# EAGLE design Prototipo_1.2 (EAGLE 6.1)
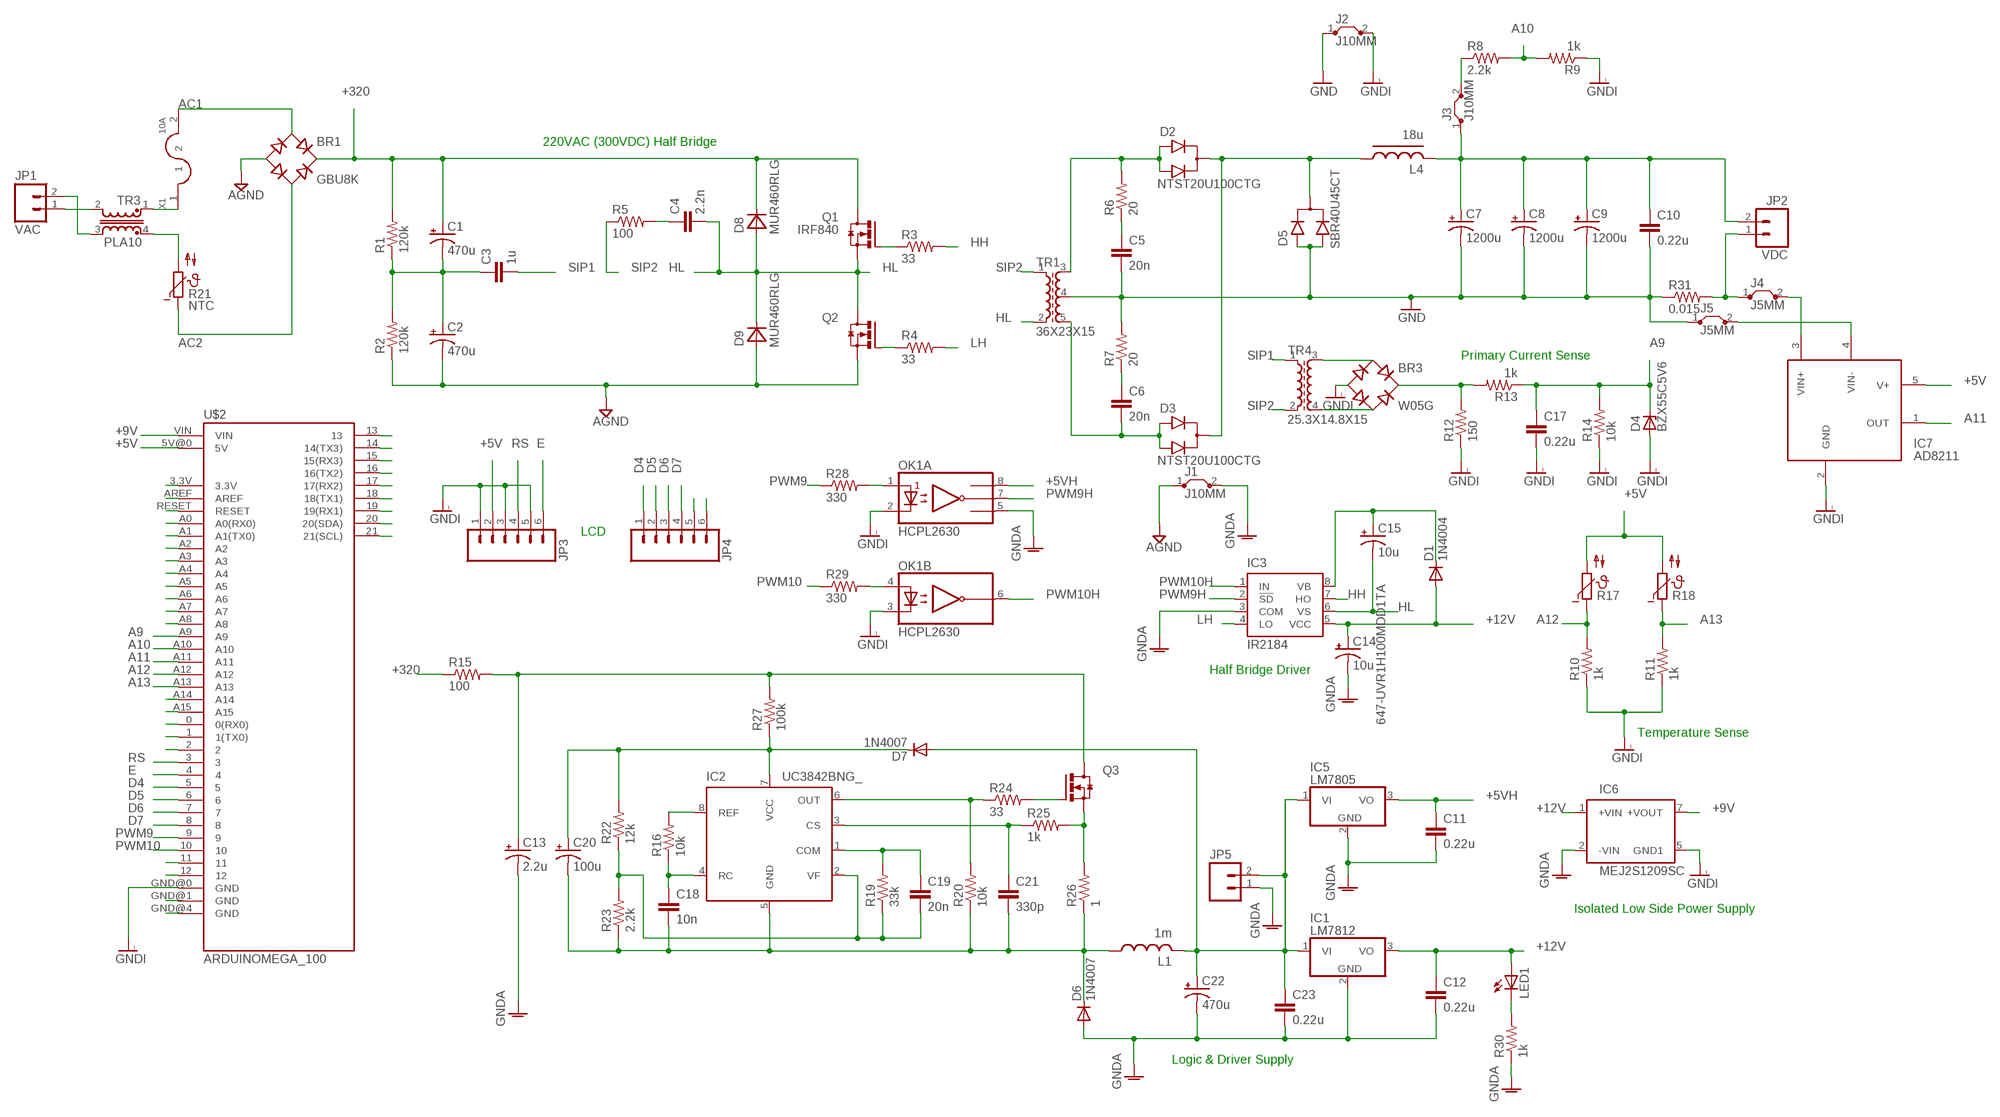
[diagram p0: schematic, sheet 1]

## Parts
BR1  GBU8K  [GBU]
BR3  W05G  [WOG]
C1  470u  CAP_470UF_250V  [CPOL_RADIAL_470UF_250V]
C2  470u  CAP_470UF_250V  [CPOL_RADIAL_470UF_250V]
C3  1u  C22/8  [C22.5B8]
C4  2.2n  C7.5/4  [C7.5B4]
C5  20n  C10/4  [C10B4]
C6  20n  C10/4  [C10B4]
C7  1200u  CAP_POLPTH4  [CPOL-RADIAL-1000UF-25V]
C8  1200u  CAP_POLPTH4  [CPOL-RADIAL-1000UF-25V]
C9  1200u  CAP_POLPTH4  [CPOL-RADIAL-1000UF-25V]
C10  0.22u  C5/3  [C5B3]
C11  0.22u  C5/3  [C5B3]
C12  0.22u  C5/3  [C5B3]
C13  2.2u  CPOL-USE5-5  [E5-5]
C14  10u  CPOL-USE2,5-6E  [E2,5-6E]
C15  10u  CPOL-USE2,5-6E  [E2,5-6E]
C17  0.22u  C5/3  [C5B3]
C18  10n  C7.5/3  [C7.5B3]
C19  20n  C10/4  [C10B4]
C20  100u  CPOL-USE2.5-7  [E2,5-7]
C21  330p  C7.5/4  [C7.5B4]
C22  470u  CPOL-USE5-8.5  [E5-8,5]
C23  0.22u  C5/3  [C5B3]
D1  1N4004  [DO41-10]
D2  NTST20U100CTG  [TO220V]
D3  NTST20U100CTG  [TO220V]
D4  BZX55C5V6  BZX55  [DO35Z10]
D5  SBR40U45CT  [TO220V]
D6  1N4007  1N4004  [DO41-10]
D7  1N4007  1N4004  [DO41-10]
D8  MUR460RLG  [CB429-17]
D9  MUR460RLG  [CB429-17]
IC1  LM7812  788TV  [TO220V]
IC2  UC3842BNG_  [DIL08]
IC3  IR2184  [DIL08]
IC5  LM7805  788TV  [TO220V]
IC6  MEJ2S1209SC  [MEJ2S1209SC]
IC7  AD8211  [RJ-5]
J1  J10MM  [10]
J2  J10MM  [10]
J3  J10MM  [10]
J4  J5MM  [05]
J5  J5MM  [05]
JP1  VAC  M023.5MM  [SCREWTERMINAL-3.5MM-2]
JP2  VDC  M025MM  [SCREWTERMINAL-5MM-2]
JP3  M06SIP  [1X06]
JP4  M06SIP  [1X06]
JP5  M02LOCK_LONGPADS  [1X02_LOCK_LONGPADS]
L1  1m  810-TSL0709RA102KR19  [E5-6]
L4  18u  CHOKE_18U  [CHOKE_18U]
LED1  LED3MM  [LED3MM]
OK1  HCPL2630  [DIL08]
Q1  IRF840  [TO220HV]
Q2  IRF840  [TO220HV]
Q3  IRF840  [TO220HV]
R1  120k  RESISTORPTH-1/4W  [AXIAL-0.4]
R2  120k  RESISTORPTH-1/4W  [AXIAL-0.4]
R3  33  RESISTORPTH-1/2W  [AXIAL-0.5]
R4  33  RESISTORPTH-1/2W  [AXIAL-0.5]
R5  100  R-US_0922V  [0922V]
R6  20  RESISTORPTH-1/2W  [AXIAL-0.5]
R7  20  RESISTORPTH-1/2W  [AXIAL-0.5]
R8  2.2k  RESISTORPTH-1/4W  [AXIAL-0.4]
R9  1k  RESISTORPTH-1/4W  [AXIAL-0.4]
R10  1k  RESISTORPTH-1/4W  [AXIAL-0.4]
R11  1k  RESISTORPTH-1/4W  [AXIAL-0.4]
R12  150  RESISTORPTH-1/4W  [AXIAL-0.4]
R13  1k  RESISTORPTH-1/4W  [AXIAL-0.4]
R14  10k  RESISTORPTH-1/4W  [AXIAL-0.4]
R15  100  RESISTORPTH-1/4W  [AXIAL-0.4]
R16  10k  RESISTORPTH-1/4W  [AXIAL-0.4]
R17  NTC640  [P640]
R18  NTC640  [P640]
R19  33k  RESISTORPTH-1/4W  [AXIAL-0.4]
R20  10k  RESISTORPTH-1/4W  [AXIAL-0.4]
R21  NTC  NTC_5D2-14LD  [C075-042X103]
R22  12k  RESISTORPTH-1/4W  [AXIAL-0.4]
R23  2.2k  RESISTORPTH-1/4W  [AXIAL-0.4]
R24  33  RESISTORPTH-1/2W  [AXIAL-0.5]
R25  1k  RESISTORPTH-1/4W  [AXIAL-0.4]
R26  1  RESISTORPTH-1/4W  [AXIAL-0.4]
R27  100k  RESISTORPTH-1/4W  [AXIAL-0.4]
R28  330  RESISTORPTH-1/4W  [AXIAL-0.4]
R29  330  RESISTORPTH-1/4W  [AXIAL-0.4]
R30  1k  RESISTORPTH-1/4W  [AXIAL-0.4]
R31  0.015  RSENSE  [RSENSE]
TR1  36X23X15  36X23X15_N87  [CORE_36X23X15]
TR3  PLA10  COMMON_MODE_CHOKE_PLA10  [COMMON_MODE_CHOKE_PLA10]
TR4  25.3X14.8X15  25.3X14.8X15_N87  [CORE_25.3X14.8X15]
U$2  ARDUINOMEGA_100  [ARDUINOMEGA_100]
X1  10A  FUSE_HOLDER_5X20  [FUSE_HOLDER_5X20]

## Nets
$N15 [LVHC]: D2.2(C) D3.2(C) D5.2(C) L4.1
+5V [LVLC]: IC7.5(V+) JP3.2 R17.2 R18.2 U$2.5V@0(5V)
+5VH: C11.1 IC5.3(VO) OK1.8(A:VCC)
+9V [LVLC]: IC6.7(+VOUT) U$2.VIN
+12V [HVMC]: C12.1 C14.+ D1.A IC1.3(VO) IC3.5(VCC) IC6.1(+VIN) LED1.A
+320 [HVHC]: BR1.4(+) C1.1(+) D8.C Q1.2(D) R1.P$2 R15.P$1
A9 [LVLC]: C17.1 D4.C R13.P$1 R14.P$2 U$2.A9
A10 [LVLC]: R8.P$2 R9.P$2 U$2.A10
A11 [LVLC]: IC7.1(OUT) U$2.A11
A12 [LVLC]: R10.P$2 R17.1 U$2.A12
A13 [LVLC]: R11.P$2 R18.1 U$2.A13
AC1 [HVHC]: BR1.2(AC1) X1.2
AC2 [HVHC]: BR1.3(AC2) R21.1
AGND [HVHC]: BR1.1(-) C2.2(-) D9.A J1.1 Q2.3(S) R2.P$1
D4 [LVLC]: JP4.1 U$2.5
D5 [LVLC]: JP4.2 U$2.6
D6 [LVLC]: JP4.3 U$2.7
D7 [LVLC]: JP4.4 U$2.8
E [LVLC]: JP3.6 U$2.4
GND [LVHC]: C5.2 C7.2(-) C8.2(-) C9.2(-) C10.2 D5.1(A1) D5.3(A2) J2.1 J5.1 R7.P$2 R31.P$1 TR1.4
GNDA [HVMC]: C11.2 C12.2 C13.- C14.- C22.- C23.2 D6.A IC1.2(GND) IC3.3(COM) IC5.2(GND) IC6.2(-VIN) J1.2 JP5.1 OK1.5(A:GND) R30.P$1
GNDI [LVLC]: BR3.- C17.2 D4.A IC6.5(GND1) IC7.2(GND) J2.2 JP3.1 JP3.3 JP3.5 OK1.2(A:C1) OK1.3(B:C2) R9.P$1 R10.P$1 R11.P$1 R12.P$1 R14.P$1 U$2.GND@0(GND)
HH: IC3.7(HO) R3.P$2
HL [HVHC]: C4.2 C15.- D8.A D9.C IC3.6(VS) Q1.3(S) Q2.2(D) TR1.2
LH: IC3.4(LO) R4.P$2
N$1 [LVLC]: OK1.1(A:A1) R28.P$2
N$2 [HVHC]: R21.2 TR3.4
N$3 [HVHC]: C1.2(-) C2.1(+) C3.1 R1.P$1 R2.P$2
N$4 [LVLC]: J3.2 R8.P$1
N$5 [HVHC]: TR3.1 X1.1
N$6 [LVLC]: BR3.AC1 TR4.3
N$7 [HVHC]: C4.1 R5.2
N$8 [HVHC]: JP1.1 TR3.2
N$9 [HVHC]: JP1.2 TR3.3
N$10: Q1.1(G) R3.P$1
N$11: Q2.1(G) R4.P$1
N$12 [LVHC]: C5.1 R6.P$1
N$13 [LVHC]: D2.1(A1) D2.3(A2) R6.P$2 TR1.3
N$14 [LVSHC]: C7.1(+) C8.1(+) C9.1(+) C10.1 J3.1 JP2.2 L4.2
N$15: IC2.8(REF) R16.P$2
N$16 [LVLC]: BR3.AC2 TR4.4
N$17 [LVHC]: C6.1 R7.P$1
N$18 [LVLC]: BR3.+ R12.P$2 R13.P$2
N$19 [LVHC]: C6.2 D3.1(A1) D3.3(A2) TR1.5
N$20: C18.1 IC2.4(RC) R16.P$1
N$21 [HVMC]: C22.+ C23.1 D7.A IC1.1(VI) IC5.1(VI) JP5.2 L1.-
N$22: C19.1 IC2.1(COM) R19.P$2
N$23: C20.+ D7.C IC2.7(VCC) R22.P$2 R27.P$1
N$24: C19.2 IC2.2(VF) R19.P$1 R22.P$1 R23.P$2
N$25: IC2.6(OUT) R20.P$2 R24.P$1
N$26: C15.+ D1.C IC3.8(VB)
N$27 [HVMC]: C18.2 C20.- C21.2 D6.C IC2.5(GND) L1.+ R20.P$1 R23.P$1 R26.P$1
N$28: Q3.1(G) R24.P$2
N$29 [HVMC]: Q3.3(S) R25.P$2 R26.P$2
N$30 [HVMC]: C13.+ Q3.2(D) R15.P$2 R27.P$2
N$31: C21.1 IC2.3(CS) R25.P$1
N$32 [LVLC]: OK1.4(B:A2) R29.P$2
N$33 [LVLC]: IC7.3(VIN+) J4.2
N$34 [LVLC]: U$2.A14
N$35 [LVLC]: U$2.A15
N$36 [LVLC]: U$2.13
N$37 [LVLC]: U$2.14(14(TX3))
N$38 [LVLC]: U$2.15(15(RX3))
N$39 [LVLC]: U$2.16(16(TX2))
N$40 [LVLC]: U$2.17(17(RX2))
N$41 [LVLC]: U$2.18(18(TX1))
N$42 [LVLC]: U$2.19(19(RX1))
N$43 [LVLC]: U$2.20(20(SDA))
N$44 [LVLC]: U$2.21(21(SCL))
N$45 [LVLC]: U$2.A8
N$46 [LVLC]: U$2.A7
N$47 [LVLC]: U$2.A6
N$48 [LVLC]: U$2.A5
N$49 [LVLC]: U$2.A4
N$50 [LVLC]: U$2.A3
N$51 [LVLC]: U$2.A2
N$52 [LVLC]: U$2.A1(A1(TX0))
N$53 [LVLC]: U$2.A0(A0(RX0))
N$54 [LVLC]: U$2.RESET
N$55 [LVLC]: U$2.AREF
N$56 [LVLC]: U$2.3.3V
N$57 [LVLC]: U$2.0(0(RX0))
N$58 [LVLC]: U$2.1(1(TX0))
N$59 [LVLC]: U$2.2
N$60 [LVLC]: U$2.11
N$61 [LVLC]: U$2.12
N$62 [LVLC]: U$2.GND@1(GND)
N$63 [LVLC]: U$2.GND@4(GND)
N$64 [LVLC]: JP4.5
N$65 [LVLC]: JP4.6
N$66 [HVMC]: LED1.K(C) R30.P$2
N$67 [LVLC]: IC7.4(VIN-) J5.2
N$68 [LVSHC]: J4.1 JP2.1 R31.P$2
PWM9 [LVLC]: R28.P$1 U$2.9
PWM9H: IC3.2(!SD) OK1.7(A:VO1)
PWM10 [LVLC]: R29.P$1 U$2.10
PWM10H: IC3.1(IN) OK1.6(B:VO2)
RS [LVLC]: JP3.4 U$2.3
SIP1 [HVHC]: C3.2 TR4.1
SIP2 [HVHC]: R5.1 TR1.1 TR4.2

## Notes on the sheet
- 220VAC (300VDC) Half Bridge
- Primary Current Sense
- LCD
- Half Bridge Driver
- Temperature Sense
- Isolated Low Side Power Supply
- Logic & Driver Supply

## Library data of the parts
BR1 = finger_sun:GBU8K
BR3 = dbridge:W*G: Vishay/General Semiconductor W005G - W10G Bridge rectifier, 1.5A, 50 to 1000V
C1 C2 = finger_sun:CAP_470UF_250V: Capacitor Polarized These are standard SMD and PTH capacitors. Normally 10uF, 47uF, and 100uF in electrolytic and tantalum varieties. Always verify the external diameter of the through hole cap, it varies with capacity, voltage, and manufacturer. The EIA devices should be standard.
C3 C4 C18 = capacitor-wima:C: CAPACITOR naming: grid - package width
C5 C6 C19 = capacitor-wima:C: CAPACITOR naming: grid - package width; MOUSER: 594-S203M75Z5UN63J0R
C7-C9 = SparkFun-Passives:CAP_POL: Capacitor Polarized These are standard SMD and PTH capacitors. Normally 10uF, 47uF, and 100uF in electrolytic and tantalum varieties. Always verify the external diameter of the through hole cap, it varies with capacity, voltage, and manufacturer. The EIA devices should be standard.; MOUSER: 667-EEU-FR1V122B
C10-C12 C17 C23 = capacitor-wima:C: CAPACITOR naming: grid - package width; MOUSER: 80-R82DC3220AA60K
C13 = adafruit:CPOL-US: POLARIZED CAPACITOR, American symbol; MOUSER: 80-ESH225M400AG3AA
C14 C15 = adafruit:CPOL-US: POLARIZED CAPACITOR, American symbol; MOUSER: 647-UVR1H100MDD1TA
C20 = adafruit:CPOL-US: POLARIZED CAPACITOR, American symbol; MOUSER: 140-REA101M1HBK0811P
C21 = capacitor-wima:C: CAPACITOR naming: grid - package width; MOUSER: 72-VY2331K29Y5SS63V7
C22 = adafruit:CPOL-US: POLARIZED CAPACITOR, American symbol; MOUSER: 647-UVR1V471MPD1TD
D1 = diode:1N4004: DIODE general purpose rectifier, 1 A; MOUSER: 512-1N4007
D2 D3 = finger_sun:NTST20U100CTG
D4 = diode:BZX55: Z DIODE; MOUSER: 78-BZX55C5V6-TAP
D5 = finger_sun:SBR40U45CT
D6 D7 = diode:1N4004: DIODE general purpose rectifier, 1 A
D8 D9 = finger_sun:MUR460RLG
IC1 = linear:78*: Positive VOLTAGE REGULATOR Source: http://cache.national.com/ds/LM/LM78L05.pdf http://www.fairchildsemi.com/ds/LM/LM7805.pdf; MOUSER: 863-MC7812CTG
IC2 = finger_sun:UC3842BNG_
IC3 = finger_sun:IR2184: HALF-BRIDGE DRIVER www.irf.com Data Sheet No. PD60174 revG Features *Floating channel designed for bootstrap operation Fully operational to +600V *Tolerant to negative transient voltage dV/dt immune * Gate drive supply range from 10 to 20V * Undervoltage lockout for both channels * 3.3V and 5V input logic compatible * Matched propagation delay for both channels * Logic and power ground +/- 5V offset. * Lower di/dt gate driver for better noise immunity * Output source/sink current capability 1.4A/1.8A * Also available LEAD-FREE (PbF); MF: INTERNATIONAL RECTIFIER(IR); MPN: IR2184
IC5 = linear:78*: Positive VOLTAGE REGULATOR Source: http://cache.national.com/ds/LM/LM78L05.pdf http://www.fairchildsemi.com/ds/LM/LM7805.pdf
IC6 = finger_sun:MEJ2S1209SC
IC7 = finger_sun:AD8211
J1-J5 = jumper:J: Bridge
JP1 JP2 JP5 = SparkFun-Connectors:M02: Header 2 Standard 2-pin 0.1" header. Use with straight break away headers (SKU : PRT-00116), right angle break away headers (PRT-00553), swiss pins (PRT-00743), machine pins (PRT-00117), and female headers (PRT-00115). Molex polarized connector foot print use with SKU : PRT-08233 with associated crimp pins and housings.
JP3 JP4 = SparkFun-Connectors:M06: Header 6 Standard 6-pin 0.1" header. Use with straight break away headers (SKU : PRT-00116), right angle break away headers (PRT-00553), swiss pins (PRT-00743), machine pins (PRT-00117), and female headers (PRT-00115). Molex polarized connector foot print use with SKU : PRT-08094 with associated crimp pins and housings. NOTES ON THE VARIANTS LOCK and LOCK_LONGPADS... This footprint was designed to help hold the alignment of a through-hole component (i.e. 6-pin header) while soldering it into place. You may notice that each hole has been shifted either up or down by 0.005 of an inch from it's more standard position (which is a perfectly straight line). This slight alteration caused the pins (the squares in the middle) to touch the edges of the holes. Because they are alternating, it causes a "brace" to hold the component in place. 0.005 has proven to be the perfect amount of "off-center" position when using our standard breakaway headers. Although looks a little odd when you look at the bare footprint, once you have a header in there, the alteration is very hard to notice. Also, if you push a header all the way into place, it is covered up entirely on the bottom side. This idea of altering the position of holes to aid alignment will be further integrated into the Sparkfun Library for other footprints. It can help hold any component with 3 or more connection pins.
L1 = finger_sun:810-TSL0709RA102KR19; MOUSER: 810-TSL0709RA102KR19
L4 = finger_sun:CHOKE_18U: Choke Toroid 18uH 18.5A 652-2300LL-180-V-RC
LED1 = adafruit:LED: LED OSRAM: - CHIPLED LG R971, LG N971, LY N971, LG Q971, LY Q971, LO R971, LY R971 LH N974, LH R974 LS Q976, LO Q976, LY Q976 LO Q996 - Hyper CHIPLED LW Q18S LB Q993, LB Q99A, LB R99A - SideLED LS A670, LO A670, LY A670, LG A670, LP A670 LB A673, LV A673, LT A673, LW A673 LH A674 LY A675 LS A676, LA A676, LO A676, LY A676, LW A676 LS A679, LY A679, LG A679 - Hyper Micro SIDELED® LS Y876, LA Y876, LO Y876, LY Y876 LT Y87S - SmartLED LW L88C, LW L88S LB L89C, LB L89S, LG L890 LS L89K, LO L89K, LY L89K LS L896, LA L896, LO L896, LY L896 - TOPLED LS T670, LO T670, LY T670, LG T670, LP T670 LSG T670, LSP T670, LSY T670, LOP T670, LYG T670 LG T671, LOG T671, LSG T671 LB T673, LV T673, LT T673, LW T673 LH T674 LS T676, LA T676, LO T676, LY T676, LB T676, LH T676, LSB T676, LW T676 LB T67C, LV T67C, LT T67C, LS T67K, LO T67K, LY T67K, LW E67C LS E67B, LA E67B, LO E67B, LY E67B, LB E67C, LV E67C, LT E67C LW T67C LS T679, LY T679, LG T679 LS T770, LO T770, LY T770, LG T770, LP T770 LB T773, LV T773, LT T773, LW T773 LH T774 LS E675, LA E675, LY E675, LS T675 LS T776, LA T776, LO T776, LY T776, LB T776 LHGB T686 LT T68C, LB T68C - Hyper Mini TOPLED® LB M676 - Mini TOPLED Santana® LG M470 LS M47K, LO M47K, LY M47K Source: http://www.osram.convergy.de/
OK1 = optocoupler:HCPL2630: HEWLETT PACKARD OPTO COUPLER; MF: AGILENT TECHNOLOGIES; MPN: HCPL-2630-000E; OC_FARNELL: 9994904; OC_NEWARK: 88H7813
Q1-Q3 = finger_sun:IRF840
R1 R2 = SparkFun-Passives:RESISTOR: Resistor Basic schematic elements and footprints for 0603, 1206, and PTH resistors.; MOUSER: 660-MF1/4DCT52R1203F
R3 R4 R8 = SparkFun-Passives:RESISTOR: Resistor Basic schematic elements and footprints for 0603, 1206, and PTH resistors.
R5 = adafruit:R-US_: RESISTOR, American symbol
R6 R7 = SparkFun-Passives:RESISTOR: Resistor Basic schematic elements and footprints for 0603, 1206, and PTH resistors.; MOUSER: 603-MFR50SFTE52-20R
R9-R11 R13 R25 R30 = SparkFun-Passives:RESISTOR: Resistor Basic schematic elements and footprints for 0603, 1206, and PTH resistors.; MOUSER: 660-MF1/4DC1001F
R12 = SparkFun-Passives:RESISTOR: Resistor Basic schematic elements and footprints for 0603, 1206, and PTH resistors.; MOUSER: 660-MF1/4DC1500F
R14 R16 R20 = SparkFun-Passives:RESISTOR: Resistor Basic schematic elements and footprints for 0603, 1206, and PTH resistors.; MOUSER: 660-MF1/4DC1002F
R15 = SparkFun-Passives:RESISTOR: Resistor Basic schematic elements and footprints for 0603, 1206, and PTH resistors.; MOUSER: 660-MF1/4DC1000F
R17 R18 = ptc-ntc:NTC640: PHILIPS NTC; MOUSER: 594-NTCLE203E3502JB0; OC_FARNELL: unknown; OC_NEWARK: unknown
R19 = SparkFun-Passives:RESISTOR: Resistor Basic schematic elements and footprints for 0603, 1206, and PTH resistors.; MOUSER: 660-MF1/4DC3302F
R21 = finger_sun:NTC_5D2-14LD
R22 = SparkFun-Passives:RESISTOR: Resistor Basic schematic elements and footprints for 0603, 1206, and PTH resistors.; MOUSER: 660-MF1/4DCT52R1202F
R23 = SparkFun-Passives:RESISTOR: Resistor Basic schematic elements and footprints for 0603, 1206, and PTH resistors.; MOUSER: 660-MF1/4DCT52R2201F
R24 = SparkFun-Passives:RESISTOR: Resistor Basic schematic elements and footprints for 0603, 1206, and PTH resistors.; MOUSER: 603-MFR50SFTE52-33R
R26 = SparkFun-Passives:RESISTOR: Resistor Basic schematic elements and footprints for 0603, 1206, and PTH resistors.; MOUSER: 660-MF1/4DCT52R1R00F
R27 = SparkFun-Passives:RESISTOR: Resistor Basic schematic elements and footprints for 0603, 1206, and PTH resistors.; MOUSER: 660-MF1/4DC1003F
R28 R29 = SparkFun-Passives:RESISTOR: Resistor Basic schematic elements and footprints for 0603, 1206, and PTH resistors.; MOUSER: MF1/4DC3300F
R31 = finger_sun:RSENSE: Open Air Sense Resistor - TT Electronics
TR1 = finger_sun:36X23X15_N87
TR3 = finger_sun:COMMON_MODE_CHOKE_PLA10: Common Mode Choke (EMI Filter) PLA10
TR4 = finger_sun:25.3X14.8X15_N87
U$2 = prymia:ARDUINOMEGA_100
X1 = finger_sun:FUSE_HOLDER_5X20: Fuse Holder - Fuse Cartridge 5x20mm

## Net classes
0 HVLC: clearance 0.762 mm
1 HVHC: width 0.762 mm, clearance 1.016 mm to class 0, clearance 1.016 mm
2 LVHC: width 2.794 mm, clearance 5.08 mm to class 0, clearance 5.08 mm to class 1
3 LVLC: width 0.381 mm, clearance 5.08 mm to class 0, clearance 5.08 mm to class 1, clearance 0.508 mm
4 LVSHC: width 5.08 mm, clearance 5.08 mm to class 0, clearance 5.08 mm to class 1
5 HVMC: width 0.762 mm, clearance 0.762 mm to class 0, clearance 1.27 mm to class 1, clearance 5.08 mm to class 2, clearance 5.08 mm to class 3, clearance 5.08 mm to class 4, clearance 0.889 mm

## Board
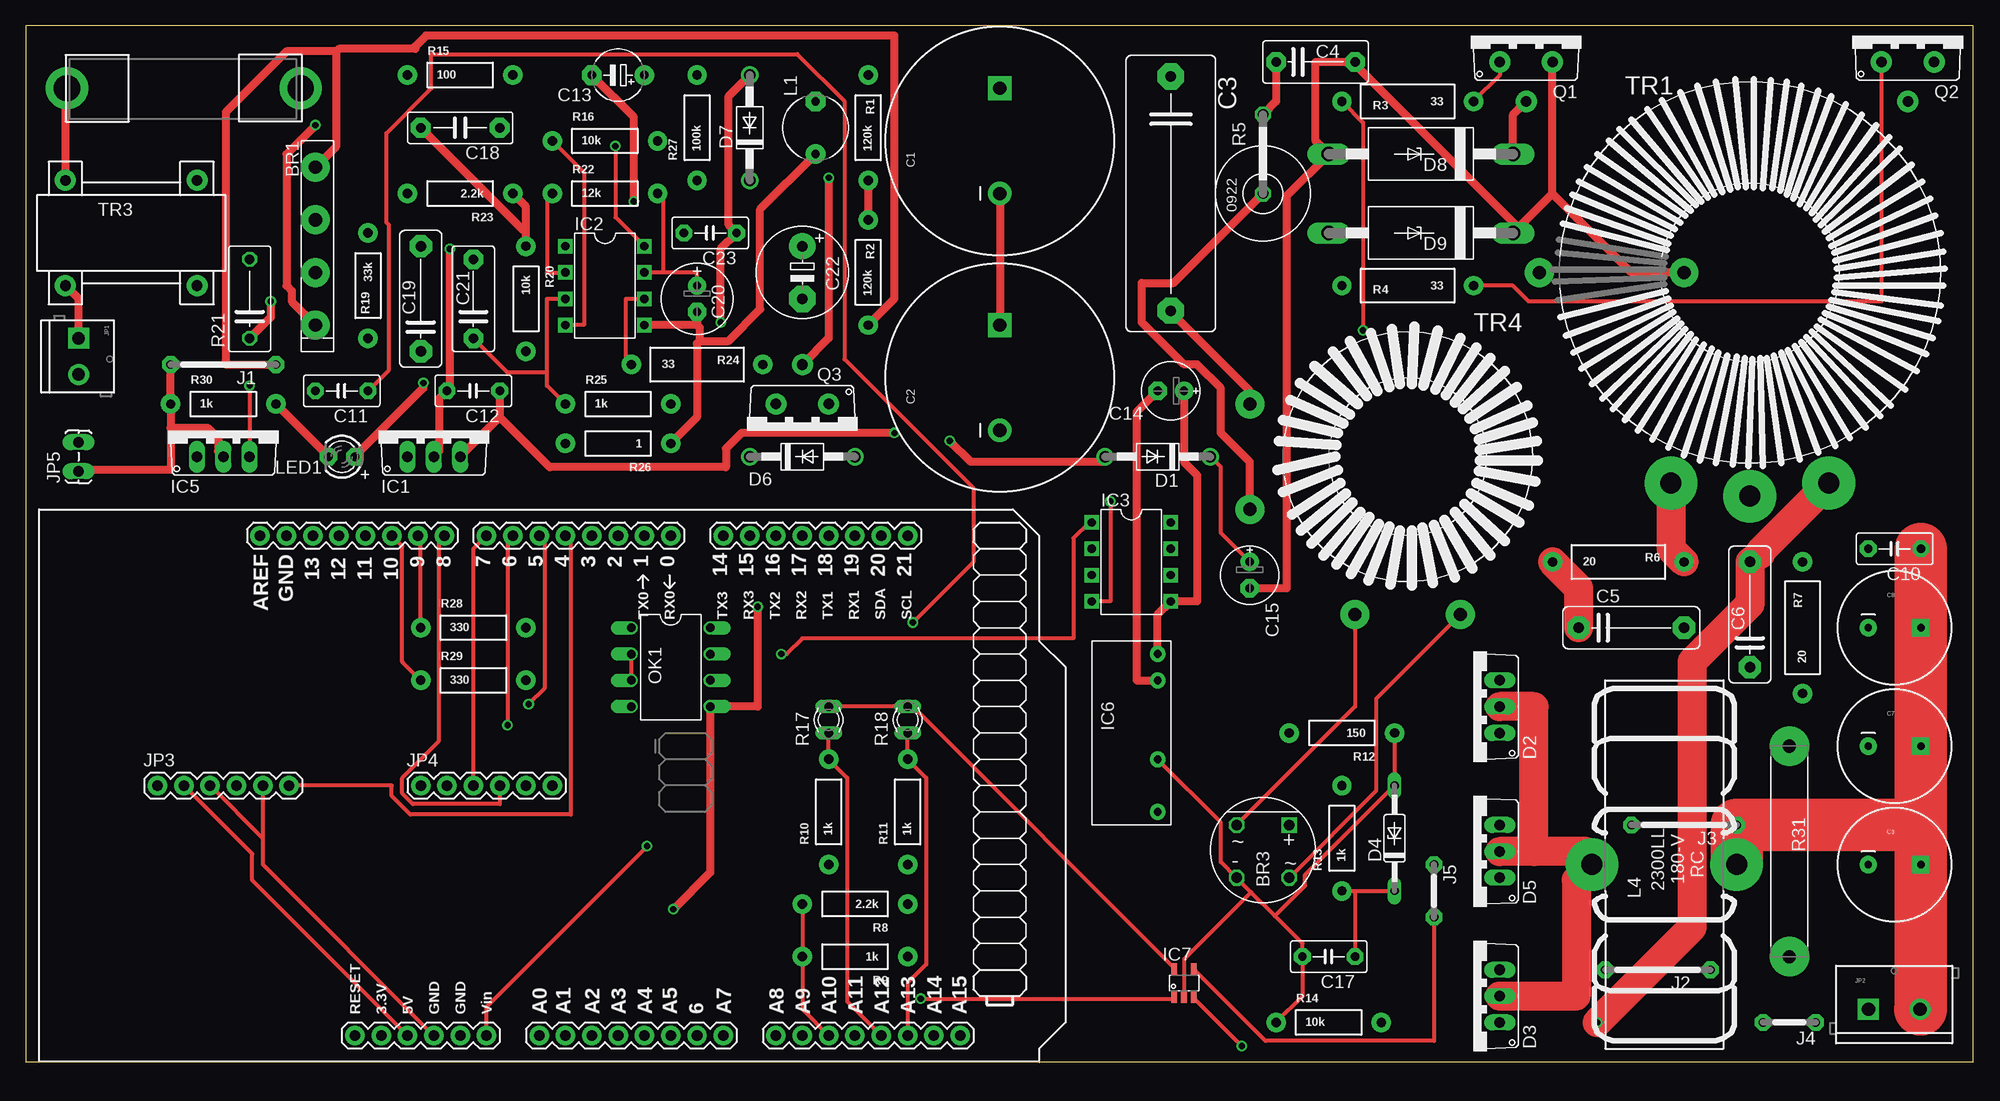
[diagram p1: board, top side]
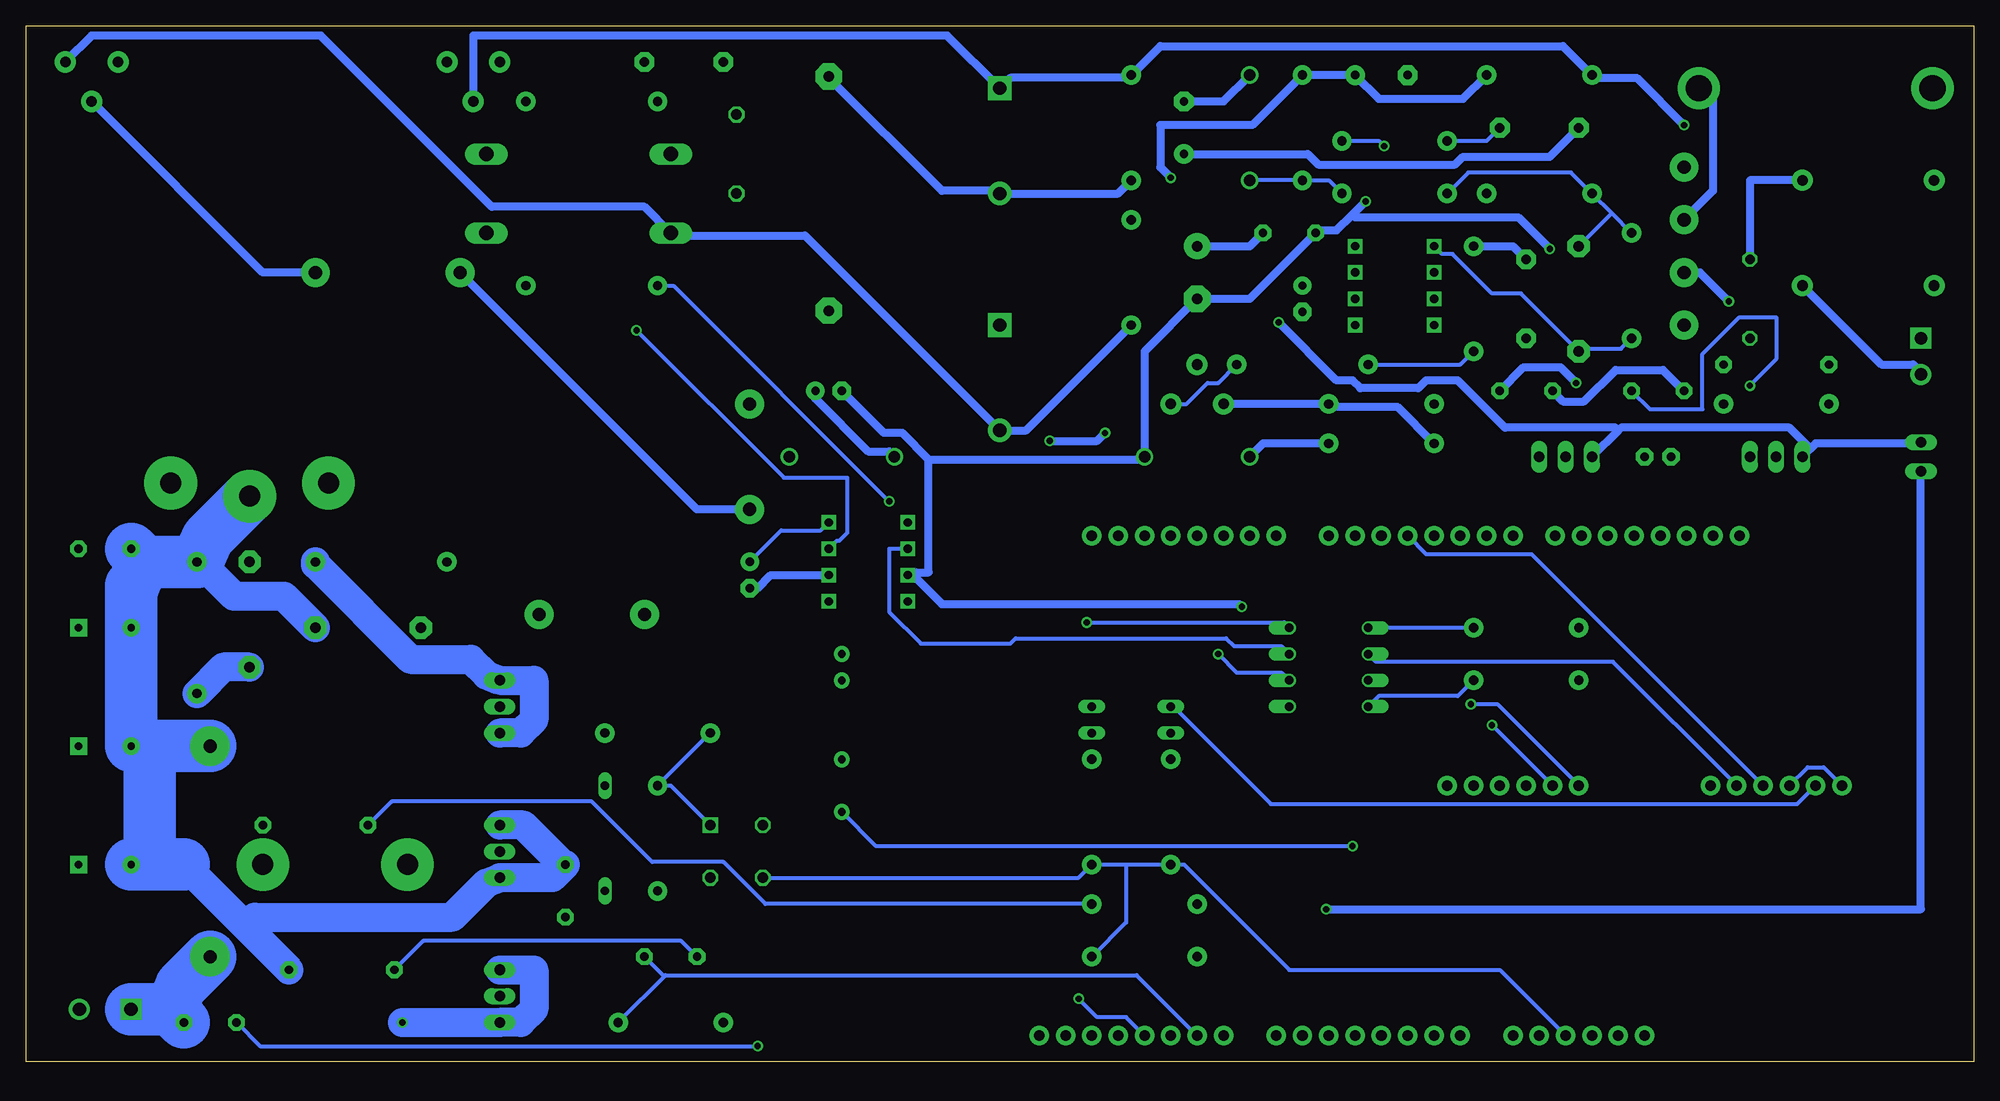
[diagram p2: board, bottom side, seen from below]

Size 187.94 x 100 mm. Coordinates in mm from the lower left corner, seen from the top.
Outline: 0,0 187.94,0 187.94,100 0,100 0,0
Copper layers (1*16): Top 0.035mm / dielectric 1.5mm / Bottom 0.035mm
Design rules: minimum track width 15mil, minimum drill 24mil, track to track 15mil, track to pad 15mil, pad to pad 15mil, via to via 15mil, smd to smd 15mil, copper to edge 40mil, drill to drill 8mil, minimum pad ring 10mil, minimum via ring 8mil, stop-mask expansion 4mil, vias tented up to drill 0mil, thermal gap 10mil

### Footprints (pad centres in the part's own frame; a part is rotated, then mirrored left to right if it is on the bottom)
GBU = drill 1.27 pad 2.794: 1 -5.08,0; 2 0,0; 3 5.08,0; 4 10.16,0
WOG = drill 1.016 square: + 2.54,2.54 | drill 1.016 octagon: - -2.54,-2.54; AC1 -2.54,2.54; AC2 2.54,-2.54
CPOL_RADIAL_470UF_250V = drill 1.27 pad 2.286 square: 1 5.08,0 | drill 1.27 pad 2.286: 2 -5.08,0
C22.5B8 = drill 1.016 pad 2.54 octagon: 1 -11.303,0; 2 11.303,0
C7.5B4 = drill 0.914 pad 1.905 octagon: 1 -3.81,0; 2 3.81,0
C10B4 = drill 1.016 pad 2.159 octagon: 1 -5.08,0; 2 5.08,0
CPOL-RADIAL-1000UF-25V = drill 0.7 pad 1.651 square: 1 2.54,0 | drill 0.7 pad 1.651: 2 -2.54,0
C5B3 = drill 0.813 pad 1.6 octagon: 1 -2.54,0; 2 2.54,0
E5-5 = drill 0.813 pad 1.905: + -2.54,0 | drill 0.813 pad 1.905 octagon: - 2.54,0
E2,5-6E = drill 0.813 pad 1.778: + -1.27,0 | drill 0.813 pad 1.778 octagon: - 1.27,0
C7.5B3 = drill 0.914 pad 1.905 octagon: 1 -3.81,0; 2 3.81,0
E2,5-7 = drill 0.813 pad 1.778: + -1.27,0 | drill 0.813 pad 1.778 octagon: - 1.27,0
E5-8,5 = drill 1.016 pad 2.54: + -2.54,0 | drill 1.016 pad 2.54 octagon: - 2.54,0
DO41-10 = drill 1.118: A 5.08,0; C -5.08,0
TO220V = drill 1.016 long: 1 -2.54,-2.54; 2 0,-2.54; 3 2.54,-2.54
DO35Z10 = drill 0.813 long: A 5.08,0; C -5.08,0
CB429-17 = drill 1.397 long: A 8.89,0; C -8.89,0
DIL08 = drill 0.8 pad 1.4 square: 1 -3.81,-3.81; 2 -1.27,-3.81; 3 1.27,-3.81; 4 3.81,-3.81; 5 3.81,3.81; 6 1.27,3.81; 7 -1.27,3.81; 8 -3.81,3.81
MEJ2S1209SC = drill 0.762 pad 1.524: 1 0,0; 2 2.54,0; 5 10.16,0; 7 15.24,0
RJ-5 = smd 0.55 x 1.2: 1 -0.95,-1.3; 2 0,-1.3; 3 0.95,-1.3; 4 0.95,1.3; 5 -0.95,1.3
10 = drill 0.813 pad 1.6 octagon: 1 -5.08,0; 2 5.08,0
05 = drill 0.813 pad 1.6 octagon: 1 -2.54,0; 2 2.54,0
SCREWTERMINAL-3.5MM-2 = drill 1.2 pad 2.032 square: 1 0,0 | drill 1.2 pad 2.032: 2 3.5,0
SCREWTERMINAL-5MM-2 = drill 1.3 pad 2.032 square: 1 0,0 | drill 1.3 pad 2.032: 2 5,0
1X06 = drill 1.016 pad 1.88: 1 0,0; 2 2.54,0; 3 5.08,0; 4 7.62,0; 5 10.16,0; 6 12.7,0
1X02_LOCK_LONGPADS = drill 1.016 long: 1 -0.127,0; 2 2.667,0
E5-6 = drill 0.813 pad 1.905: + -2.54,0 | drill 0.813 pad 1.905 octagon: - 2.54,0
CHOKE_18U = drill 2.032 pad 5.08: 1 0,0; 2 0,-13.97
LED3MM = drill 0.813 pad 1.676 octagon: A -1.27,0; K 1.27,0
DIL08' = drill 0.813 offset: 1 -3.81,-3.81; 2 -1.27,-3.81; 3 1.27,-3.81; 4 3.81,-3.81; 5 3.81,3.81; 6 1.27,3.81; 7 -1.27,3.81; 8 -3.81,3.81
TO220HV = drill 1.016 pad 2.032: 1 -2.54,0; 2 0,-3.81; 3 2.54,0
AXIAL-0.4 = drill 0.9 pad 1.88: P$1 -5.08,0; P$2 5.08,0
AXIAL-0.5 = drill 0.9 pad 1.88: P$1 -6.35,0; P$2 6.35,0
0922V = drill 1.016 octagon: 1 -5.08,0; 2 2.54,0
P640 = drill 0.813 long: 1 -1.27,0; 2 1.27,0
C075-042X103 = drill 0.914 octagon: 1 -3.81,0; 2 3.81,0
RSENSE = drill 1.27 pad 3.81: P$1 -10.16,0; P$2 10.16,0
CORE_36X23X15 = drill 1.27 pad 2.794: 1 -20.32,0; 2 -6.35,0 | drill 2.032 pad 5.08: 3 -7.62,-20.32; 4 0,-21.59; 5 7.62,-20.32
COMMON_MODE_CHOKE_PLA10 = drill 1.016 pad 2.032: 1 -6.35,5.08; 2 -6.35,-5.08; 3 6.35,-5.08; 4 6.35,5.08
CORE_25.3X14.8X15 = drill 1.27 pad 2.794: 1 -15.24,5.08; 2 -15.24,-5.08; 3 -5.08,-15.24; 4 5.08,-15.24
ARDUINOMEGA_100 = drill 1.016 pad 1.88: 0 60.96,50.8; 1 58.42,50.8; 2 55.88,50.8; 3 53.34,50.8; 3.3V 33.02,2.54; 4 50.8,50.8; 5 48.26,50.8; 5V@0 35.56,2.54; 6 45.72,50.8; 7 43.18,50.8; 8 39.116,50.8; 9 36.576,50.8; 10 34.036,50.8; 11 31.496,50.8; 12 28.956,50.8; 13 26.416,50.8; 14 66.04,50.8; 15 68.58,50.8; 16 71.12,50.8; 17 73.66,50.8; 18 76.2,50.8; 19 78.74,50.8; 20 81.28,50.8; 21 83.82,50.8; A0 48.26,2.54; A1 50.8,2.54; A2 53.34,2.54; A3 55.88,2.54; A4 58.42,2.54; A5 60.96,2.54; A6 63.5,2.54; A7 66.04,2.54; A8 71.12,2.54; A9 73.66,2.54; A10 76.2,2.54; A11 78.74,2.54; A12 81.28,2.54; A13 83.82,2.54; A14 86.36,2.54; A15 88.9,2.54; AREF 21.336,50.8; GND@0 38.1,2.54; GND@1 40.64,2.54; GND@4 23.876,50.8; RESET 30.48,2.54; VIN 43.18,2.54
FUSE_HOLDER_5X20 = drill 2.54 pad 4.064: 1 0,12.54; 2 0,-10

### Placement (x,y rotation side)
BR1  27.94,81.28 270 top
BR3  119.38,20.32 0 top
C1  93.98,88.9 90 top
C2  93.98,66.04 90 top
C3  110.49,83.82 270 top
C4  124.46,96.52 0 top
C5  154.94,41.91 0 top
C6  166.37,43.18 90 top
C7  180.34,30.48 0 top
C8  180.34,41.91 0 top
C9  180.34,19.05 0 top
C10  180.34,49.53 180 top
C11  30.48,64.77 180 top
C12  43.18,64.77 180 top
C13  57.15,95.25 180 top
C14  110.49,64.77 180 top
C15  118.11,46.99 270 top
C17  125.73,10.16 180 top
C18  41.91,90.17 180 top
C19  38.1,73.66 90 top
C20  64.77,73.66 270 top
C21  43.18,73.66 90 top
C22  74.93,76.2 270 top
C23  66.04,80.01 180 top
D1  109.22,58.42 180 top
D2  139.7,34.29 90 top
D3  139.7,6.35 90 top
D4  132.08,21.59 90 top
D5  139.7,20.32 90 top
D6  74.93,58.42 0 top
D7  69.85,90.17 90 top
D8  134.62,87.63 180 top
D9  134.62,80.01 180 top
IC1  39.37,60.96 0 top
IC2  55.88,74.93 270 top
IC3  106.68,48.26 270 top
IC5  19.05,60.96 0 top
IC6  109.22,39.37 270 top
IC7  111.76,7.62 0 top
J1  19.05,67.31 180 top
J2  157.48,8.89 180 top
J3  160.02,22.86 180 top
J4  170.18,3.81 180 top
J5  135.89,16.51 270 top
JP1  5.08,69.85 270 top
JP2  177.8,5.08 0 top
JP3  12.7,26.67 0 top
JP4  38.1,26.67 0 top
JP5  5.08,57.15 90 top
L1  76.2,90.17 90 top
L4  151.13,19.05 90 top
LED1  30.48,58.42 180 top
OK1  HCPL2630  [DIL08']  62.23,38.1 270 top
Q1  144.78,96.52 0 top
Q2  181.61,96.52 0 top
Q3  74.93,63.5 180 top
R1  81.28,90.17 90 top
R2  81.28,76.2 90 top
R3  133.35,92.71 180 top
R4  133.35,74.93 180 top
R5  119.38,88.9 90 top
R6  153.67,48.26 0 top
R7  171.45,41.91 90 top
R8  80.01,15.24 180 top
R9  80.01,10.16 180 top
R10  77.47,24.13 90 top
R11  85.09,24.13 90 top
R12  127,31.75 180 top
R13  127,21.59 90 top
R14  125.73,3.81 0 top
R15  41.91,95.25 0 top
R16  55.88,88.9 0 top
R17  77.47,33.02 90 top
R18  85.09,33.02 90 top
R19  33.02,74.93 270 top
R20  48.26,73.66 270 top
R21  21.59,73.66 90 top
R22  55.88,83.82 0 top
R23  41.91,83.82 180 top
R24  64.77,67.31 0 top
R25  57.15,63.5 0 top
R26  57.15,59.69 180 top
R27  64.77,90.17 90 top
R28  43.18,41.91 0 top
R29  43.18,36.83 0 top
R30  19.05,63.5 0 top
R31  170.18,20.32 270 top
TR1  166.37,76.2 0 top
TR3  10.16,80.01 0 top
TR4  133.35,58.42 0 top
U$2  1.27,0 0 top
X1  16.51,93.98 90 top

### Tracks (layer width: path | path; a pad name or v marks a point on that pad's centre or on a via)
$N15
  Top 2.794: D3.2 149.61,6.35 149.61,17.53 L4.1 150.62,20.32 145.54,20.32 | 145.54,20.32 D5.2 | D2.2 145.54,34.29 145.54,20.32
+5V
  Top 0.381: JP3.2 21.84,20.07 21.84,17.53 U$2.5V@0 | IC7.5 110.74,9.14 85.6,34.29 R18.2 R17.2
  Bottom 0.381: JP3.2 17.02,24.89 67.82,24.89 77.22,34.29 R17.2
+5VH  (via drill 0.61)
  Top 0.381: v85.6,42.42 91.44,48.26 91.44,55.37 78.99,67.82 78.99,92.71 74.42,97.28 39.12,97.28 39.12,93.98 34.8,89.66 34.8,81.03 35.05,80.77 35.05,66.8 C11.1 | v21.59,65.28 IC5.3
  Bottom 0.381: OK1.8 66.55,42.42 v85.6,42.42 | v21.59,65.28 19.05,67.82 19.05,71.88 22.61,71.88 26.16,68.33 26.16,62.99 31.24,62.99 C11.1
+9V  (via drill 0.61)
  Top 0.381: v59.94,20.83 44.45,5.33 U$2.VIN
  Bottom 0.381: IC6.7 105.92,20.83 v59.94,20.83
+12V  (via drill 0.61)
  Top 0.762: 45.72,62.23 IC1.3 | C12.1 45.72,62.23 | LED1.A 38.35,65.02 v38.35,65.53 | IC6.1 109.22,43.18 IC3.5 113.03,44.45 113.03,56.64 111.76,57.91 C14.+ | 45.72,62.23 50.55,57.4 67.56,57.4 67.56,59.18 69.09,60.71 v83.82,60.71 | v89.15,59.94 91.19,57.91 104.14,57.91 D1.A
  Bottom 0.762: v38.35,65.53 39.88,67.06 43.43,67.06 C12.1 | D1.A 104.65,58.93 106.68,58.93 111.76,64.01 C14.+ | v83.82,60.71 84.58,59.94 v89.15,59.94
+320  (via drill 0.61)
  Top 0.762: Q1.2 143.51,91.44 D8.C | BR1.4 25.65,73.41 25.65,74.42 25.15,74.93 25.15,87.63 v27.94,90.42
  Bottom 0.762: v27.94,90.42 32.51,95 36.58,95 R15.P$1 39.62,98.04 78.49,98.04 R1.P$2 81.53,95 92.96,95 C1.1 99.06,99.06 144.78,99.06 Q1.2
A9
  Top 0.381: R13.P$1 128.27,16.51 | 128.27,16.51 D4.C | 128.27,16.51 C17.1
  Bottom 0.381: U$2.A9 80.77,8.38 126.24,8.38 | 126.24,8.38 126.49,8.38 C17.1 | 126.24,8.38 R14.P$2
A10
  Top 0.381: R8.P$2 R9.P$2 74.93,5.08 U$2.A10
A11  (via drill 0.61)
  Top 0.381: v86.36,6.1 110.74,6.1 IC7.1
  Bottom 0.381: v86.36,6.1 84.58,4.32 81.79,4.32 U$2.A11
A12
  Top 0.381: R17.1 R10.P$2 79.25,27.43 79.25,5.84 U$2.A12
A13
  Top 0.381: R18.1 R11.P$2 86.87,27.43 86.87,9.4 85.09,7.62 U$2.A13
AC1
  Bottom 0.762: BR1.2 25.15,84.07 25.15,93.98 X1.2
AC2  (via drill 0.61)
  Top 0.762: R21.1 23.62,71.88 v23.62,73.41
  Bottom 0.762: v23.62,73.41 26.42,76.2 BR1.3
AGND
  Top 0.762: J1.1 19.3,67.31 19.3,91.69 25.15,97.54 29.97,97.54 | 29.97,97.54 29.97,88.39 BR1.1 | R2.P$1 83.82,73.66 83.82,99.06 38.61,99.06 37.59,98.04 37.59,97.79 30.23,97.79 29.97,97.54
  Bottom 0.762: R2.P$1 91.44,60.96 C2.2 112.78,79.76 125.48,79.76 D9.A 128.27,82.55 143,82.55 159.51,99.06 181.61,99.06 Q2.3
D4  (via drill 0.61)
  Top 0.381: v48.51,34.54 50.04,36.07 50.04,50.29 U$2.5
  Bottom 0.381: JP4.1 45.97,34.54 v48.51,34.54
D5  (via drill 0.61)
  Top 0.381: v46.48,32.51 46.48,50.29 U$2.6
  Bottom 0.381: v46.48,32.51 JP4.2
D6
  Top 0.381: JP4.3 43.18,49.53 U$2.7
D7
  Top 0.381: U$2.8 39.88,50.29 39.88,30.99 36.32,27.43 36.32,25.91 37.34,24.89 45.72,24.89 JP4.4
E
  Top 0.381: JP3.6 35.31,26.67 35.31,25.65 37.08,23.88 52.58,23.88 52.58,50.29 U$2.4
GND
  Bottom 2.794: C5.2 163.07,44.96 167.89,44.96 170.43,47.5 R7.P$2 | J5.1 136.02,18.92 | 136.02,18.92 137.16,17.78 D5.1 143.51,17.27 146.81,13.97 165.86,13.97 166.75,13.08 | D5.3 139.95,22.86 136.02,18.92 | 172.72,19.05 166.75,13.08 | 166.75,13.08 J2.1
  Bottom 5.08: 176.53,48.26 C10.2 | 176.53,48.26 R7.P$2 170.43,50.55 TR1.4 | 176.53,48.26 177.55,45.97 177.8,45.97 C8.2 C7.2 176.02,30.48 | 172.72,19.05 176.02,19.05 | 176.02,19.05 C9.2 | R31.P$1 176.02,30.48 | 176.02,30.48 176.02,19.05
GNDA  (via drill 0.61)
  Top 0.762: IC1.2 39.88,58.93 39.88,64.01 C12.2 40.89,65.02 v40.89,78.49 | C13.- 58.67,91.19 v58.67,83.06 | IC6.2 107.19,36.83 107.19,62.74 C14.- | 13.97,61.21 R30.P$1 J1.2 | 13.97,61.21 13.97,57.15 5.08,57.15 JP5.1 | IC5.2 18.54,58.93 18.54,60.2 17.53,61.21 13.97,61.21 | v70.61,43.94 70.61,34.29 OK1.5 66.04,18.29 v62.48,14.73
  Bottom 0.762: C11.2 29.97,66.8 34.54,66.8 37.59,63.75 39.62,63.75 C12.2 | 59.94,81.79 61.47,80.26 63.25,80.26 C23.2 69.85,73.66 C22.- 80.01,68.58 D6.A 80.26,58.17 100.84,58.17 | 59.94,81.79 v58.67,83.06 | v40.89,78.49 43.94,81.53 59.69,81.53 59.94,81.79 | v70.61,43.94 70.87,44.2 99.57,44.2 102.36,46.99 | IC3.3 102.36,46.99 | JP5.1 5.08,14.73 v62.48,14.73 | C14.- 105.16,60.71 103.38,60.71 100.84,58.17 | 100.84,58.17 100.84,47.24 102.11,47.24 102.36,46.99
GNDI
  Top 0.381: OK1.2 OK1.3 | U$2.GND@0 22.86,19.05 22.86,21.59 | JP3.5 22.86,21.59 | 22.86,21.59 JP3.3 | R12.P$1 D4.A 123.44,18.03 123.44,17.02 120.52,14.1 | 120.52,14.1 123.19,11.43 C17.2 123.19,6.35 R14.P$1 | 120.52,14.1 118.24,16.38 | 118.24,16.38 BR3.- 115.32,19.3 115.32,23.11 IC6.5 | IC7.2 111.76,9.91 118.24,16.38
  Bottom 0.381: JP3.1 14.48,28.45 16,28.45 JP3.3 | OK1.2 57.66,38.61 34.8,38.61 JP3.5 | 81.79,19.05 R11.P$1 86.36,17.78 BR3.- | 81.79,19.05 R10.P$1 76.2,19.05 66.04,8.89 45.72,8.89 U$2.GND@0 | R9.P$1 81.79,13.46 81.79,19.05 | J2.2 149.61,11.68 124.71,11.68 C17.2
HH  (via drill 0.61)
  Top 0.381: v129.03,70.61 129.03,90.68 R3.P$2
  Bottom 0.381: IC3.7 109.73,50.29 109.47,50.29 108.71,51.05 108.71,56.39 114.81,56.39 v129.03,70.61
HL
  Top 0.762: 147.32,83.82 Q1.3 | 147.32,83.82 D9.C 143.76,80.77 128.52,96.01 128.52,96.27 C4.2 124.46,96.52 124.46,88.9 D8.A 121.67,83.57 121.67,45.72 C15.- | 147.32,83.82 154.94,76.2 TR1.2
  Bottom 0.762: Q2.2 165.1,76.2 TR1.2 | IC3.6 116.08,46.99 117.35,45.72 C15.-
LH  (via drill 0.61)
  Top 0.381: IC3.4 104.65,44.45 v104.65,54.1
  Bottom 0.381: v104.65,54.1 125.48,74.93 R4.P$2
N$1
  Bottom 0.381: R28.P$2 OK1.1
N$2
  Bottom 0.762: R21.2 21.59,85.09 TR3.4
N$3
  Top 0.762: R1.P$1 R2.P$2 | C1.2 C2.1
  Bottom 0.762: R1.P$1 82.55,83.82 C1.2 94.23,84.07 99.57,84.07 110.49,95 C3.1
N$4
  Bottom 0.381: J3.2 152.65,25.15 133.35,25.15 127.51,19.3 120.65,19.3 116.59,15.24 R8.P$1
N$5
  Top 0.762: TR3.1 3.81,93.98 X1.1
N$6
  Top 0.381: BR3.AC1 128.27,34.29 TR4.3
N$7
  Top 0.762: R5.2 120.65,92.71 C4.1
N$8
  Top 0.762: TR3.2 5.08,73.66 JP1.1
N$9
  Bottom 0.762: TR3.3 8.89,67.31 5.84,67.31 5.08,66.55 JP1.2
N$10
  Top 0.381: R3.P$1 142.24,95.25 Q1.1
N$11
  Top 0.381: R4.P$1 143.51,74.93 145.03,73.41 179.07,73.41 Q2.1
N$12
  Top 2.794: R6.P$1 149.86,45.72 C5.1
N$13
  Top 2.794: R6.P$2 158.75,49.53 TR1.3
  Bottom 2.794: D2.1 140.21,31.75 138.94,33.02 138.94,36.83 D2.3 143.51,37.34 145.03,38.86 150.88,38.86 160.02,48.01 R6.P$2
N$14
  Top 5.08: L4.2 J3.1 182.88,22.86 | C10.1 C8.1 C7.1 182.88,22.86 | 182.88,22.86 C9.1 182.88,5.08 JP2.2
N$15  (via drill 0.61)
  Top 0.381: IC2.8 56.9,81.53 v56.9,88.39
  Bottom 0.381: v56.9,88.39 57.4,88.9 R16.P$2
N$16
  Top 0.381: BR3.AC2 130.3,26.16 130.3,35.05 TR4.4
N$17
  Bottom 2.794: R7.P$1 168.91,38.1 C6.1
N$18
  Bottom 0.381: BR3.+ 125.73,26.67 R13.P$2 R12.P$2
N$19  (via drill 0.61)
  Top 2.794: v151.64,3.81 160.78,12.95 160.78,38.61 166.37,44.2 C6.2 167.39,49.02 167.39,49.28 TR1.5
  Bottom 2.794: D3.3 138.94,8.89 138.94,5.08 140.21,3.81 D3.1 v151.64,3.81
N$20
  Top 0.381: IC2.4 53.85,71.12 53.85,85.85 R16.P$1
  Bottom 0.381: C18.1 46.99,88.9 R16.P$1
N$21  (via drill 0.61)
  Top 0.762: D7.A 67.82,93.22 67.82,80.77 C23.1 67.06,78.49 v67.06,71.37
  Bottom 0.762: D7.A 72.39,92.71 L1.- | C23.1 69.85,78.74 C22.+ | JP5.2 5.08,59.69 15.24,59.69 IC5.1 16,59.44 17.78,61.21 34.04,61.21 34.29,60.96 | 34.29,60.96 IC1.1 | v67.06,71.37 61.47,65.79 59.94,65.79 59.18,65.02 53.59,65.02 52.83,65.79 49.78,65.79 45.21,61.21 34.54,61.21 34.29,60.96
N$22
  Bottom 0.381: IC2.1 51.31,77.98 50.29,77.98 46.48,74.17 43.69,74.17 C19.1 38.1,68.83 34.04,68.83 R19.P$2
N$23
  Top 0.381: 61.47,76.2 64.77,76.2 C20.+ | 61.47,76.2 IC2.7 | 61.47,76.2 61.47,83.31 R22.P$2
  Bottom 0.381: D7.C R27.P$1 62.23,85.09 R22.P$2
N$24
  Top 0.381: IC2.2 50.29,76.2 50.29,83.31 R22.P$1
  Bottom 0.381: 34.92,81.91 R23.P$2 38.86,85.85 48.77,85.85 R22.P$1 | 34.92,81.91 R19.P$1 | 34.92,81.91 C19.2
N$25
  Top 0.381: IC2.6 57.91,73.66 57.91,67.82 R24.P$1
  Bottom 0.381: R20.P$2 49.53,67.31 R24.P$1
N$26
  Top 0.381: D1.C 115.32,57.4 115.32,51.05 C15.+
  Bottom 0.381: IC3.8 111.25,51.31 115.06,51.31 C15.+
N$27
  Top 0.762: R23.P$1 48.26,82.55 48.26,80.26 | R20.P$1 48.26,80.26 | C18.2 48.01,80.26 48.26,80.26 | 64.77,71.12 IC2.5 | C20.- 64.77,71.12 | L1.+ 70.87,82.3 70.87,72.64 67.82,69.6 65.02,69.6 | 65.02,69.6 65.02,70.87 64.77,71.12 | R26.P$1 64.77,62.23 64.77,69.34 65.02,69.6
  Bottom 0.762: C21.2 44.45,78.74 R20.P$1 | D6.C 68.58,59.69 R26.P$1 | C18.2 40.89,87.38 49.28,87.38 50.04,86.61 63.25,86.61 64.26,87.63 L1.+
N$28
  Bottom 0.381: R24.P$2 72.9,65.53 73.91,65.53 75.95,63.5 Q3.1
N$29
  Bottom 0.762: R26.P$2 55.63,63.25 61.98,63.25 R25.P$2 Q3.3
N$30  (via drill 0.61)
  Top 0.762: Q3.2 77.47,69.85 v77.47,85.34
  Bottom 0.762: R15.P$2 49.28,92.96 57.4,92.96 C13.+ R27.P$2 69.6,90.42 78.49,90.42 78.49,86.36 v77.47,85.34
N$31
  Top 0.381: IC2.3 50.29,73.66 50.29,66.55 | 50.29,66.55 50.29,65.28 R25.P$1 | C21.1 46.48,66.55 50.29,66.55
N$32
  Bottom 0.381: OK1.4 57.4,35.31 49.78,35.31 R29.P$2
N$33  (via drill 0.61)
  Top 0.381: v117.35,1.52 112.78,6.1 IC7.3
  Bottom 0.381: v117.35,1.52 165.35,1.52 J4.2
N$66
  Top 0.762: R30.P$2 LED1.K
N$67
  Top 0.381: J5.2 135.89,2.03 119.63,2.03 112.78,8.89 IC7.4
N$68
  Bottom 5.08: 173.99,5.08 J4.1 | JP2.1 173.99,5.08 | R31.P$2 172.97,7.37 173.99,5.08
PWM9
  Top 0.381: U$2.9 38.1,50.55 R28.P$1
PWM9H
  Bottom 0.381: OK1.7 66.8,40.13 71.37,40.13 72.14,40.89 92.46,40.89 92.96,40.39 101.6,40.39 104.65,43.43 104.65,49.53 IC3.2
PWM10
  Top 0.381: U$2.10 36.32,49.78 36.32,38.61 R29.P$1
PWM10H  (via drill 0.61)
  Top 0.381: v72.9,39.37 73.41,39.37 74.93,40.89 101.09,40.89 101.09,50.55 102.62,52.07 IC3.1
  Bottom 0.381: OK1.6 66.8,37.59 71.12,37.59 v72.9,39.37
RS
  Bottom 0.381: JP3.4 42.67,49.02 52.83,49.02 U$2.3
SIP1
  Top 0.762: TR4.1 118.11,64.77 110.49,72.39 C3.2
SIP2
  Top 0.762: R5.1 110.74,75.18 107.7,75.18 107.7,71.37 111.76,67.31 113.03,67.31 115.32,65.02 115.32,60.71 118.11,57.91 TR4.2
  Bottom 0.762: TR1.1 123.19,53.34 TR4.2

### Text on the board
tValues: + | -